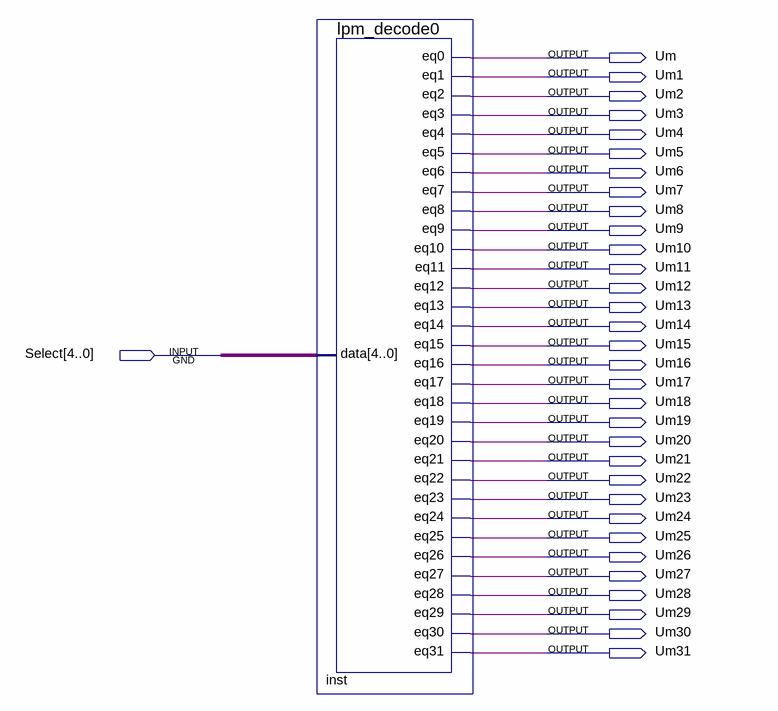
[diagram p0: schematic sheet]
// Quartus schematic Decoder.bdf as structural Verilog: 1 symbols, 33 pins
module Decoder (
  input  [4:0] Select,
  output Um,
  output Um1,
  output Um2,
  output Um3,
  output Um4,
  output Um5,
  output Um6,
  output Um7,
  output Um8,
  output Um9,
  output Um10,
  output Um11,
  output Um12,
  output Um13,
  output Um14,
  output Um15,
  output Um16,
  output Um17,
  output Um18,
  output Um19,
  output Um20,
  output Um21,
  output Um22,
  output Um23,
  output Um24,
  output Um25,
  output Um26,
  output Um27,
  output Um28,
  output Um29,
  output Um30,
  output Um31
);

  lpm_decode0 inst (
    .data(Select), .eq0(Um), .eq1(Um1), .eq2(Um2), .eq3(Um3), .eq4(Um4), .eq5(Um5), .eq6(Um6), .eq7(Um7),
    .eq8(Um8), .eq9(Um9), .eq10(Um10), .eq11(Um11), .eq12(Um12), .eq13(Um13), .eq14(Um14), .eq15(Um15),
    .eq16(Um16), .eq17(Um17), .eq18(Um18), .eq19(Um19), .eq20(Um20), .eq21(Um21), .eq22(Um22), .eq23(Um23),
    .eq24(Um24), .eq25(Um25), .eq26(Um26), .eq27(Um27), .eq28(Um28), .eq29(Um29), .eq30(Um30), .eq31(Um31));
endmodule
